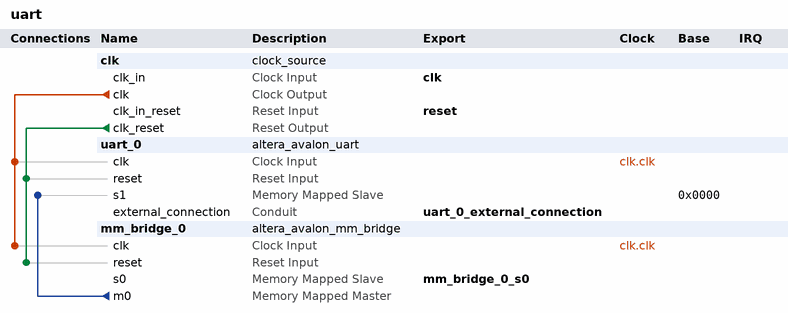
[diagram p0: system contents]
# Platform Designer (Qsys) system uart, Stratix V 5SGSMD5K2F40C2
# Parameters at their usual value, and those the tool derives, are not listed.
package require -exact qsys 13.0
create_system uart
set_project_property DEVICE_FAMILY {Stratix V}
set_project_property DEVICE 5SGSMD5K2F40C2

add_instance clk clock_source 13.0
set_instance_parameter_value clk clockFrequency 60000000

add_instance uart_0 altera_avalon_uart 13.0.1.99.2
set_instance_parameter_value uart_0 baud 115200
set_instance_parameter_value uart_0 dataBits 8
set_instance_parameter_value uart_0 fixedBaud true
set_instance_parameter_value uart_0 parity NONE
set_instance_parameter_value uart_0 stopBits 1

add_instance mm_bridge_0 altera_avalon_mm_bridge 13.0
set_instance_parameter_value mm_bridge_0 DATA_WIDTH 32
set_instance_parameter_value mm_bridge_0 ADDRESS_WIDTH 3
set_instance_parameter_value mm_bridge_0 ADDRESS_UNITS WORDS
set_instance_parameter_value mm_bridge_0 MAX_PENDING_RESPONSES 1

# connections
add_connection clk.clk mm_bridge_0.clk clock
add_connection clk.clk uart_0.clk clock
add_connection clk.clk_reset mm_bridge_0.reset reset
add_connection clk.clk_reset uart_0.reset reset
add_connection mm_bridge_0.m0 uart_0.s1 avalon
set_connection_parameter_value mm_bridge_0.m0/uart_0.s1 baseAddress 0x0000

# exported interfaces
add_interface clk clock sink
set_interface_property clk EXPORT_OF clk.clk_in
add_interface reset reset sink
set_interface_property reset EXPORT_OF clk.clk_in_reset
add_interface uart_0_external_connection conduit end
set_interface_property uart_0_external_connection EXPORT_OF uart_0.external_connection
add_interface mm_bridge_0_s0 avalon slave
set_interface_property mm_bridge_0_s0 EXPORT_OF mm_bridge_0.s0

set_interconnect_requirement {$system} qsys_mm.clockCrossingAdapter HANDSHAKE
set_interconnect_requirement {$system} qsys_mm.maxAdditionalLatency 1

save_system uart.qsys
